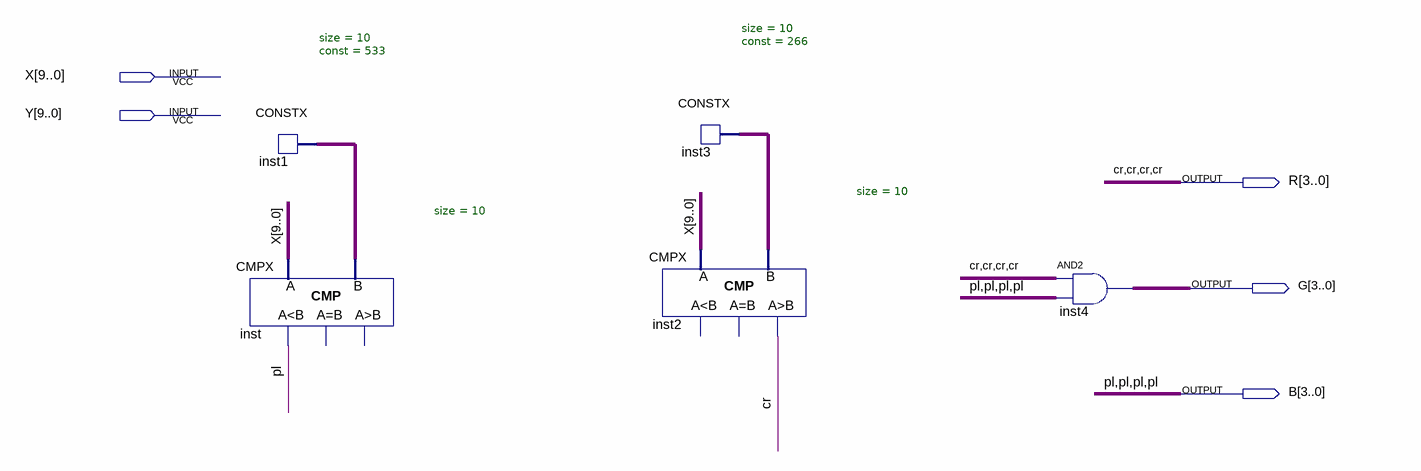
[diagram p0: schematic sheet]
// Quartus schematic zastava.bdf as structural Verilog: 5 symbols, 5 pins
module zastava (
  input  [9:0] X,
  input  [9:0] Y,
  output [3:0] R,
  output [3:0] G,
  output [3:0] B
);

  wire [9:0] inst1_data, inst3_data;

  CONSTX #(.size(10), .\const (533)) inst1 (.data(inst1_data));
  CMPX #(.size(10)) inst (.A(X), .B(inst1_data), .ls(B[3]));  // open: eq, gr
  CONSTX #(.size(10), .\const (266)) inst3 (.data(inst3_data));
  CMPX #(.size(10)) inst2 (.A(X), .B(inst3_data), .gr(R[3]));  // open: ls, eq
  assign G = {4{R[3]}} & {4{B[3]}};  // AND2 inst4, 4 bits wide

  assign B[2:0] = {3{B[3]}};
  assign R[2:0] = {3{R[3]}};

  // Other names for the same wires on the sheet: cr = R[3]; pl = B[3]
endmodule
